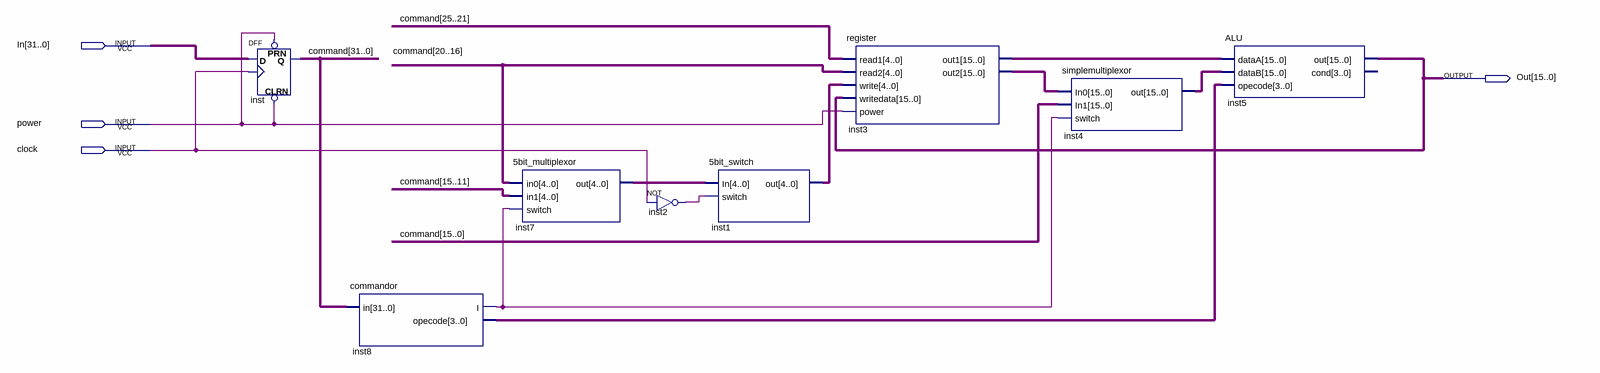
[diagram p0: schematic sheet]
// Quartus schematic Machine.bdf as structural Verilog: 8 symbols, 4 pins
module Machine (
  input  [31:0] In,
  input  power,
  input  clock,
  output [15:0] Out
);

  wire inst2_out, inst8_i;
  wire [3:0] inst8_opecode;
  wire [4:0] inst1_out, inst7_out;
  wire [15:0] inst3_out1, inst3_out2, inst4_out;
  wire [31:0] command;

  DFF inst[31:0] (.CLRN(power), .CLK(clock), .D(In), .PRN(power), .Q(command));
  commandor inst8 (.in(command), .I(inst8_i), .opecode(inst8_opecode));
  \5bit_multiplexor  inst7 (.in0(command[20:16]), .in1(command[15:11]), .switch(inst8_i), .out(inst7_out));
  not inst2 (inst2_out, clock);
  \5bit_switch  inst1 (.In(inst7_out), .switch(inst2_out), .out(inst1_out));
  register inst3 (
    .read1(command[25:21]), .read2(command[20:16]), .write(inst1_out), .writedata(Out), .power(power),
    .out1(inst3_out1), .out2(inst3_out2));
  simplemultiplexor inst4 (.In0(inst3_out2), .In1(command[15:0]), .switch(inst8_i), .out(inst4_out));
  ALU inst5 (.dataA(inst3_out1), .dataB(inst4_out), .opecode(inst8_opecode), .out(Out));  // open: cond
endmodule
